# EAGLE design INT_RACK (EAGLE 9.6.2)

## Sheet 1 of 2: LINK_Composant
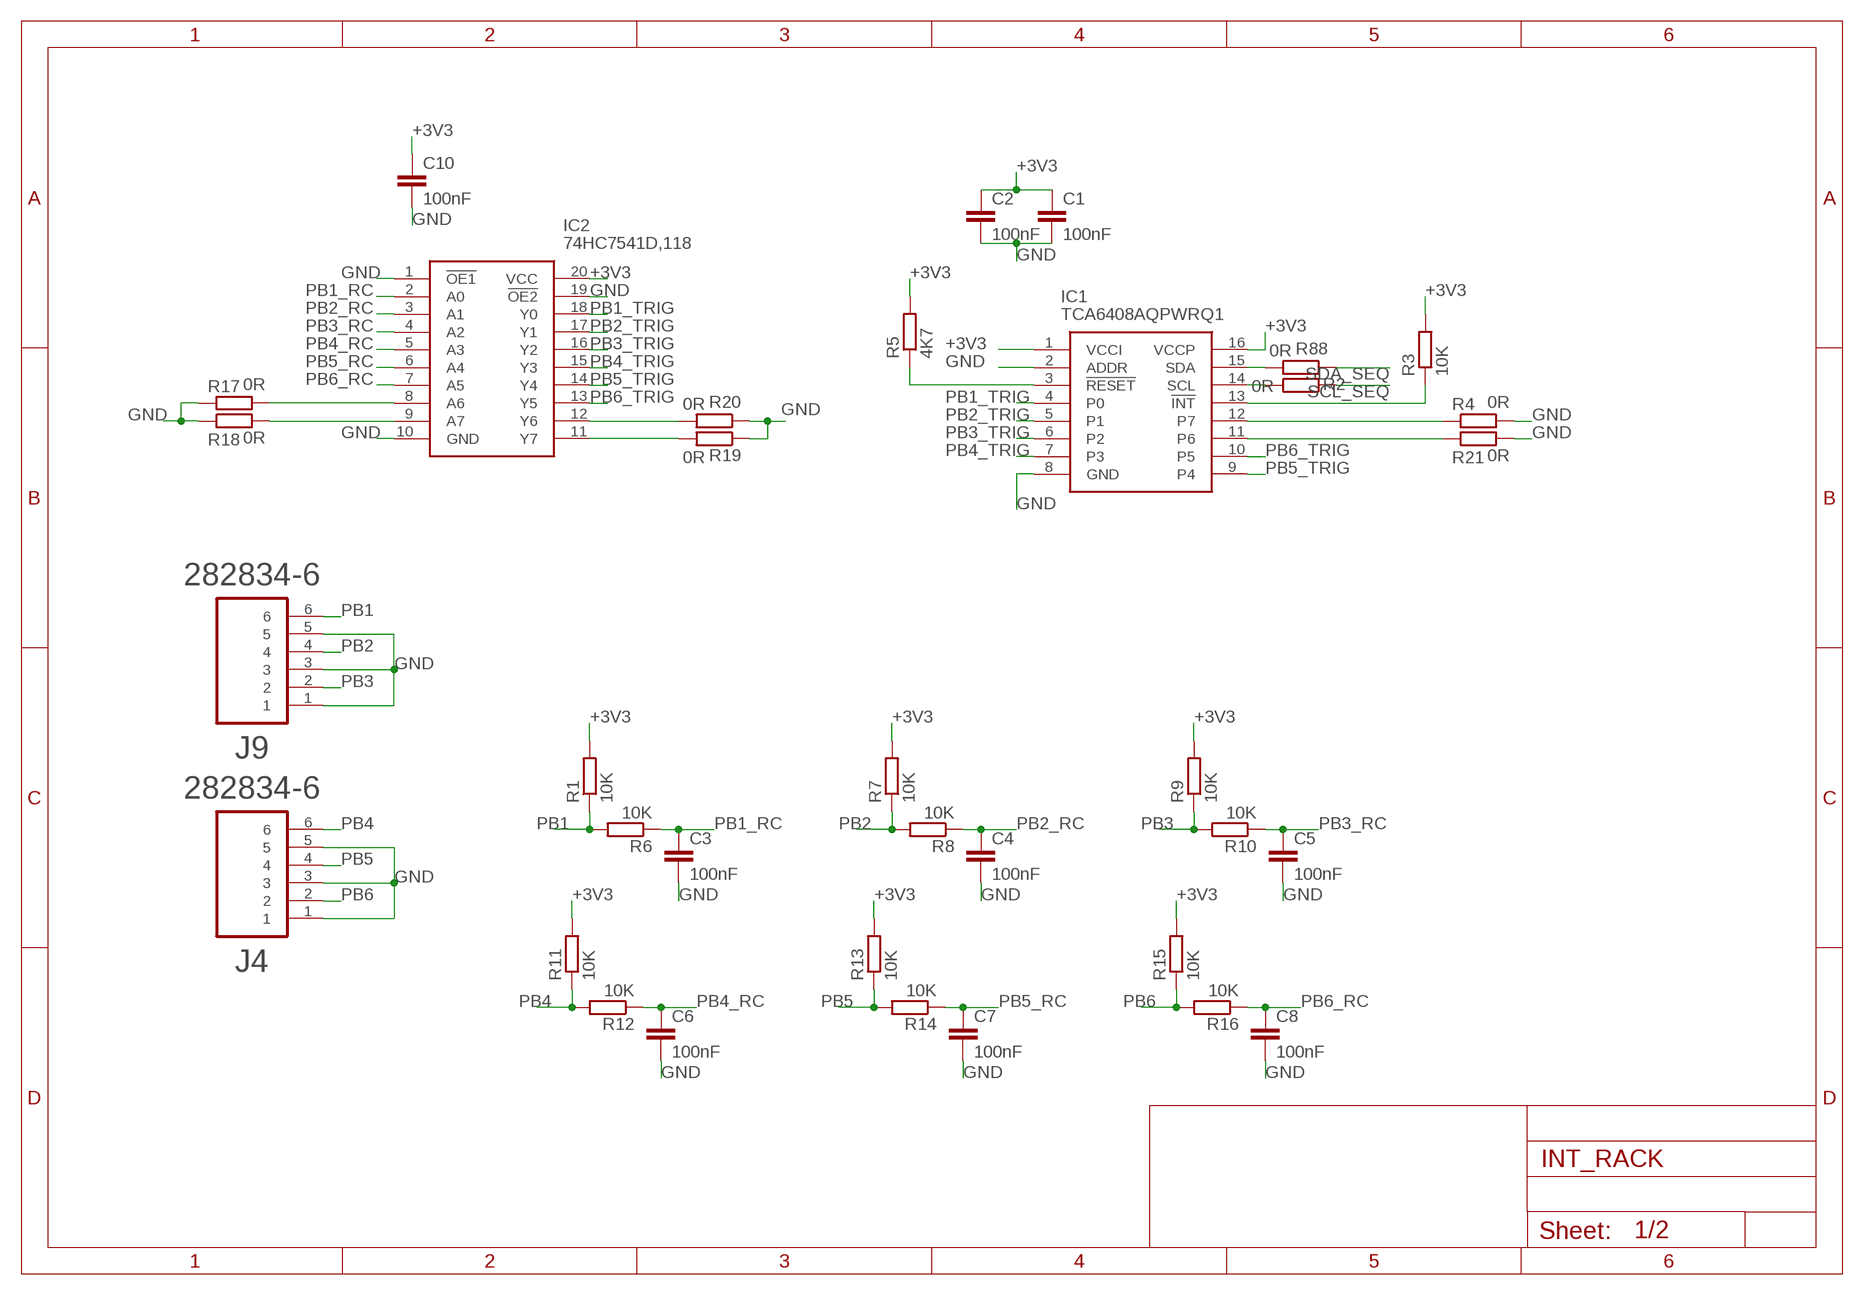
[diagram p0: schematic, sheet 1]

### Parts
C1  100nF  C-EUC0805  [C0805]
C2  100nF  C-EUC0805  [C0805]
C3  100nF  C-EUC0805  [C0805]
C4  100nF  C-EUC0805  [C0805]
C5  100nF  C-EUC0805  [C0805]
C6  100nF  C-EUC0805  [C0805]
C7  100nF  C-EUC0805  [C0805]
C8  100nF  C-EUC0805  [C0805]
C10  100nF  C-EUC0805  [C0805]
IC1  TCA6408AQPWRQ1  [SOP65P640X120-16N]
IC2  74HC7541D,118  [SOIC127P1032X265-20N]
J4  282834-6  [TE_282834-6]
J9  282834-6  [TE_282834-6]
R1  10K  R-EU_R0603  [R0603]
R2  0R  R-EU_R0603  [R0603]
R3  10K  R-EU_R0603  [R0603]
R4  0R  R-EU_R0603  [R0603]
R5  4K7  R-EU_R0603  [R0603]
R6  10K  R-EU_R0603  [R0603]
R7  10K  R-EU_R0603  [R0603]
R8  10K  R-EU_R0603  [R0603]
R9  10K  R-EU_R0603  [R0603]
R10  10K  R-EU_R0603  [R0603]
R11  10K  R-EU_R0603  [R0603]
R12  10K  R-EU_R0603  [R0603]
R13  10K  R-EU_R0603  [R0603]
R14  10K  R-EU_R0603  [R0603]
R15  10K  R-EU_R0603  [R0603]
R16  10K  R-EU_R0603  [R0603]
R17  0R  R-EU_R0603  [R0603]
R18  0R  R-EU_R0603  [R0603]
R19  0R  R-EU_R0603  [R0603]
R20  0R  R-EU_R0603  [R0603]
R21  0R  R-EU_R0603  [R0603]
R88  0R  R-EU_R0603  [R0603]

### Nets
+3V3 [Power]: C1.1 C2.1 C10.1 IC1.1(VCCI) IC1.16(VCCP) IC2.20(VCC) R1.2 R3.2 R5.2 R7.2 R9.2 R11.2 R13.2 R15.2 ; also sheet 2
GND: C1.2 C2.2 C3.2 C4.2 C5.2 C6.2 C7.2 C8.2 C10.2 IC1.2(ADDR) IC1.8(GND) IC2.1(!OE1) IC2.10(GND) IC2.19(!OE2) J4.1 J4.3 J4.5 J9.1 J9.3 J9.5 R4.2 R17.1 R18.1 R19.1 R20.1 R21.2 ; also sheet 2
N$1: IC1.11(P6) R21.1
N$2 [50Ohms]: IC1.14(SCL) R2.2
N$3: IC1.13(!INT) R3.1
N$4: IC1.12(P7) R4.1
N$5: IC1.3(!RESET) R5.1
N$6: IC2.12(Y6) R20.2
N$7: IC2.11(Y7) R19.2
N$12: IC2.8(A6) R17.2
N$13: IC2.9(A7) R18.2
N$55 [50Ohms]: IC1.15(SDA) R88.2
PB1: J9.6 R1.1 R6.2
PB1_RC: C3.1 IC2.2(A0) R6.1
PB1_TRIG: IC1.4(P0) IC2.18(Y0)
PB2: J9.4 R7.1 R8.2
PB2_RC: C4.1 IC2.3(A1) R8.1
PB2_TRIG: IC1.5(P1) IC2.17(Y1)
PB3: J9.2 R9.1 R10.2
PB3_RC: C5.1 IC2.4(A2) R10.1
PB3_TRIG: IC1.6(P2) IC2.16(Y2)
PB4: J4.6 R11.1 R12.2
PB4_RC: C6.1 IC2.5(A3) R12.1
PB4_TRIG: IC1.7(P3) IC2.15(Y3)
PB5: J4.4 R13.1 R14.2
PB5_RC: C7.1 IC2.6(A4) R14.1
PB5_TRIG: IC1.9(P4) IC2.14(Y4)
PB6: J4.2 R15.1 R16.2
PB6_RC: C8.1 IC2.7(A5) R16.1
PB6_TRIG: IC1.10(P5) IC2.13(Y5)
SCL_SEQ [50Ohms]: R2.1 ; also sheet 2
SDA_SEQ [50Ohms]: R88.1 ; also sheet 2

## Sheet 2 of 2: LINK_Connecteur
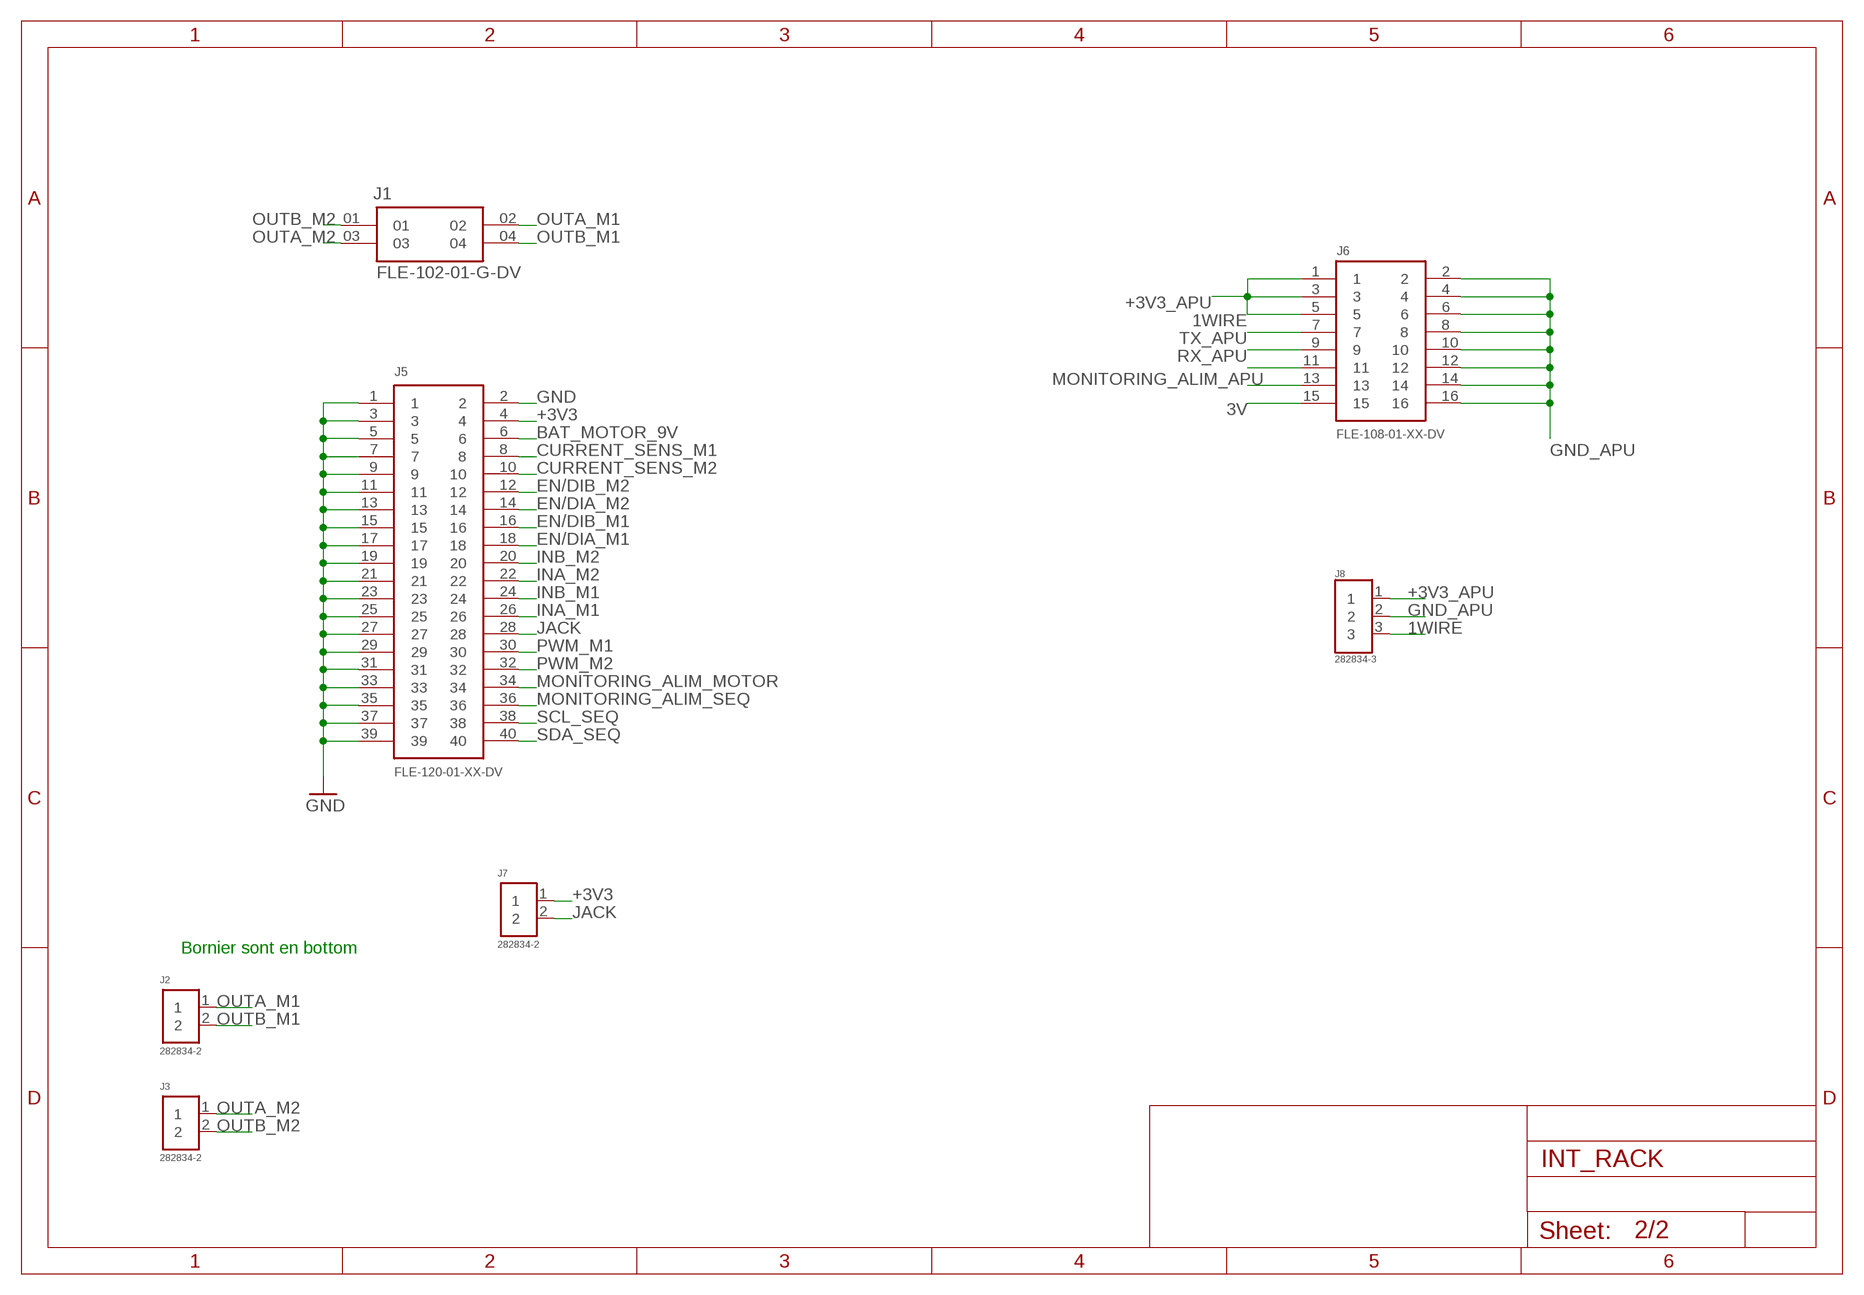
[diagram p1: schematic, sheet 2]

### Parts
J1  FLE-102-01-G-DV  [SAMTEC_FLE-102-01-G-DV]
J2  282834-2  [CONN_282834-2]
J3  282834-2  [CONN_282834-2]
J5  FLE-120-01-XX-DV  [FLE-120-01-XX-DV]
J6  FLE-108-01-XX-DV  [FLE-108-01-XX-DV]
J7  282834-2  [CONN_282834-2]
J8  282834-3  [TE_282834-3]

### Nets
1WIRE [50Ohms]: J6.7 J8.3
3V [Power]: J6.15
+3V3 [Power]: J5.4 J7.1 ; also sheet 1
+3V3_APU [Power]: J6.1 J6.3 J6.5 J8.1
BAT_MOTOR_9V [Power]: J5.6
CURRENT_SENS_M1: J5.8
CURRENT_SENS_M2: J5.10
EN/DIA_M1: J5.18
EN/DIA_M2: J5.14
EN/DIB_M1: J5.16
EN/DIB_M2: J5.12
GND: J5.1 J5.2 J5.3 J5.5 J5.7 J5.9 J5.11 J5.13 J5.15 J5.17 J5.19 J5.21 J5.23 J5.25 J5.27 J5.29 J5.31 J5.33 J5.35 J5.37 J5.39 ; also sheet 1
GND_APU: J6.2 J6.4 J6.6 J6.8 J6.10 J6.12 J6.14 J6.16 J8.2
INA_M1: J5.26
INA_M2: J5.22
INB_M1: J5.24
INB_M2: J5.20
JACK: J5.28 J7.2
MONITORING_ALIM_APU: J6.13
MONITORING_ALIM_MOTOR: J5.34
MONITORING_ALIM_SEQ: J5.36
OUTA_M1 [Motor]: J1.02 J2.1
OUTA_M2 [Motor]: J1.03 J3.1
OUTB_M1 [Motor]: J1.04 J2.2
OUTB_M2 [Motor]: J1.01 J3.2
PWM_M1: J5.30
PWM_M2: J5.32
RX_APU [50Ohms]: J6.11
SCL_SEQ [50Ohms]: J5.38 ; also sheet 1
SDA_SEQ [50Ohms]: J5.40 ; also sheet 1
TX_APU [50Ohms]: J6.9

### Notes on the sheet
- Bornier sont en bottom

## Library data of the parts
C1-C8 C10 = rcl:C-EU: CAPACITOR, European symbol; SPICEPREFIX: C
IC1 = TCA6408AQPWRQ1:TCA6408AQPWRQ1: Automotive Low-Voltage 8-Bit I2C and SMBus I/O Expander With Interrupt Output Source: Datasheet <http://www.ti.com/lit/gpn/tca6408a-q1>; ARROW_PART_NUMBER: TCA6408AQPWRQ1; ARROW_PRICE-STOCK: https://www.arrow.com/en/products/tca6408aqpwrq1/texas-instruments; DESCRIPTION: Automotive Low-Voltage 8-Bit I2C and SMBus I/O Expander With Interrupt Output; HEIGHT: 1.2mm; MANUFACTURER_NAME: Texas Instruments; MANUFACTURER_PART_NUMBER: TCA6408AQPWRQ1; MOUSER_PART_NUMBER: 595-TCA6408AQPWRQ1; MOUSER_PRICE-STOCK: https://www.mouser.co.uk/ProductDetail/Texas-Instruments/TCA6408AQPWRQ1/?qs=dn2ehRJXTX%252BDd5mX8WZrSw%3D%3D
IC2 = 74HC7541D_118:74HC7541D,118: 74HC(T)7541 - Octal Schmitt trigger buffer/line driver; 3-state@en-us Source: Datasheet <https://assets.nexperia.com/documents/data-sheet/74HC_HCT7541.pdf>; ARROW_PART_NUMBER: 74HC7541D,118; ARROW_PRICE-STOCK: https://www.arrow.com/en/products/74hc7541d118/nexperia; DESCRIPTION: 74HC(T)7541 - Octal Schmitt trigger buffer/line driver; 3-state@en-us; HEIGHT: 2.65mm; MANUFACTURER_NAME: Nexperia; MANUFACTURER_PART_NUMBER: 74HC7541D,118; MOUSER_PART_NUMBER: 771-74HC7541D-T; MOUSER_PRICE-STOCK: https://www.mouser.co.uk/ProductDetail/Nexperia/74HC7541D118?qs=P62ublwmbi8VXtyI4hHtzA%3D%3D
J1 = FLE-102-01-G-DV:FLE-102-01-G-DV: Check prices <https://pricing.snapeda.com/parts/FLE-102-01-G-DV/Samtec/view-part?ref=eda>; AVAILABILITY: Bad; DESCRIPTION: 4 Position Receptacle Connector Surface Mount; MF: Samtec; MP: FLE-102-01-G-DV; PACKAGE: None; PRICE: None; PURCHASE-URL: https://pricing.snapeda.com/search/part/FLE-102-01-G-DV/?ref=eda
J2 J3 J7 = 282834-2:282834-2: Terminal block; 2.54mm; angled 90°; 0.03÷1mm2; ways: 2; 10A; H: 10mm Check prices <https://pricing.snapeda.com/parts/282834-2/TE%20Connectivity/view-part?ref=eda>; AVAILABILITY: Good; CENTERLINE_PITCH: 2.54 mm[.1 in]; COMMENT: 282834-2; DESCRIPTION: Wire-To-Board Terminal Block, 2, 150 V, 10 A, 30 Awg, 16 Awg, 1.4 Mm; EU_ROHS_COMPLIANCE: Compliant with Exemptions; MF: TE Connectivity; MP: 282834-2; NUMBER_OF_POSITIONS: 2; PACKAGE: None; PRICE: None; PURCHASE-URL: https://pricing.snapeda.com/search/part/282834-2/?ref=eda
J4 J9 = 282834-6:282834-6: TERM BLOCK 6POS SIDE ENT 2.54MM Check prices <https://pricing.snapeda.com/parts/282834-6/TE%20Connectivity/view-part?ref=eda>; AVAILABILITY: Good; COMMENT: 282834-6; DESCRIPTION: Wire-To-Board Terminal Block, 6, 150 V, 10 A, 30 Awg, 16 Awg, 1.4 Mm; EU_ROHS_COMPLIANCE: Compliant with Exemptions; MF: TE Connectivity; MP: 282834-6; PACKAGE: None; PRICE: None; PURCHASE-URL: https://pricing.snapeda.com/search/part/282834-6/?ref=eda
J5 = FLE-120-01-XX-DV:FLE-120-01-XX-DV: DOUBLE ROW 0.050"X0.050" STRIP ASSEMBLY. Check prices <https://pricing.snapeda.com/parts/FLE-120-01-G-DV/Samtec/view-part?ref=eda>; AVAILABILITY: Bad; DESCRIPTION: 40 Position Receptacle Connector Surface Mount; MF: Samtec; MP: FLE-120-01-G-DV; PACKAGE: None; PRICE: None; PURCHASE-URL: https://pricing.snapeda.com/search/part/FLE-120-01-G-DV/?ref=eda
J6 = FLE-108-01-XX-DV:FLE-108-01-XX-DV: DOUBLE ROW 0.050"X0.050" STRIP ASSEMBLY. Check prices <https://pricing.snapeda.com/parts/FLE-108-01-G-DV/Samtec/view-part?ref=eda>; AVAILABILITY: Bad; DESCRIPTION: 16 Position Receptacle Connector Surface Mount; MF: Samtec; MP: FLE-108-01-G-DV; PACKAGE: None; PRICE: None; PURCHASE-URL: https://pricing.snapeda.com/search/part/FLE-108-01-G-DV/?ref=eda
J8 = 282834-3:282834-3: Conn; Term Blk; PCB; Wire Receptacle; 3; 2.54mm; 30-16AWG; Green; 10A; 150V; M1.6 Check prices <https://pricing.snapeda.com/parts/282834-3/TE%20Connectivity/view-part?ref=eda>; AVAILABILITY: Good; COMMENT: 282834-3; DESCRIPTION: 3 Position Wire to Board Terminal Block Horizontal with Board 0.100 (2.54mm); EU_ROHS_COMPLIANCE: Compliant with Exemptions; MF: TE Connectivity; MP: 282834-3; PACKAGE: None; PRICE: None; PURCHASE-URL: https://pricing.snapeda.com/search/part/282834-3/?ref=eda
R1-R21 R88 = rcl:R-EU_: RESISTOR, European symbol; SPICEPREFIX: R

## Net classes
0 default: width 0.2 mm, clearance 0.127 mm
1 Power: width 0.4 mm, clearance 0.2 mm
2 50Ohms: width 0.147 mm, clearance 0.127 mm
3 Motor: width 0.813 mm, clearance 1 mm

## Board
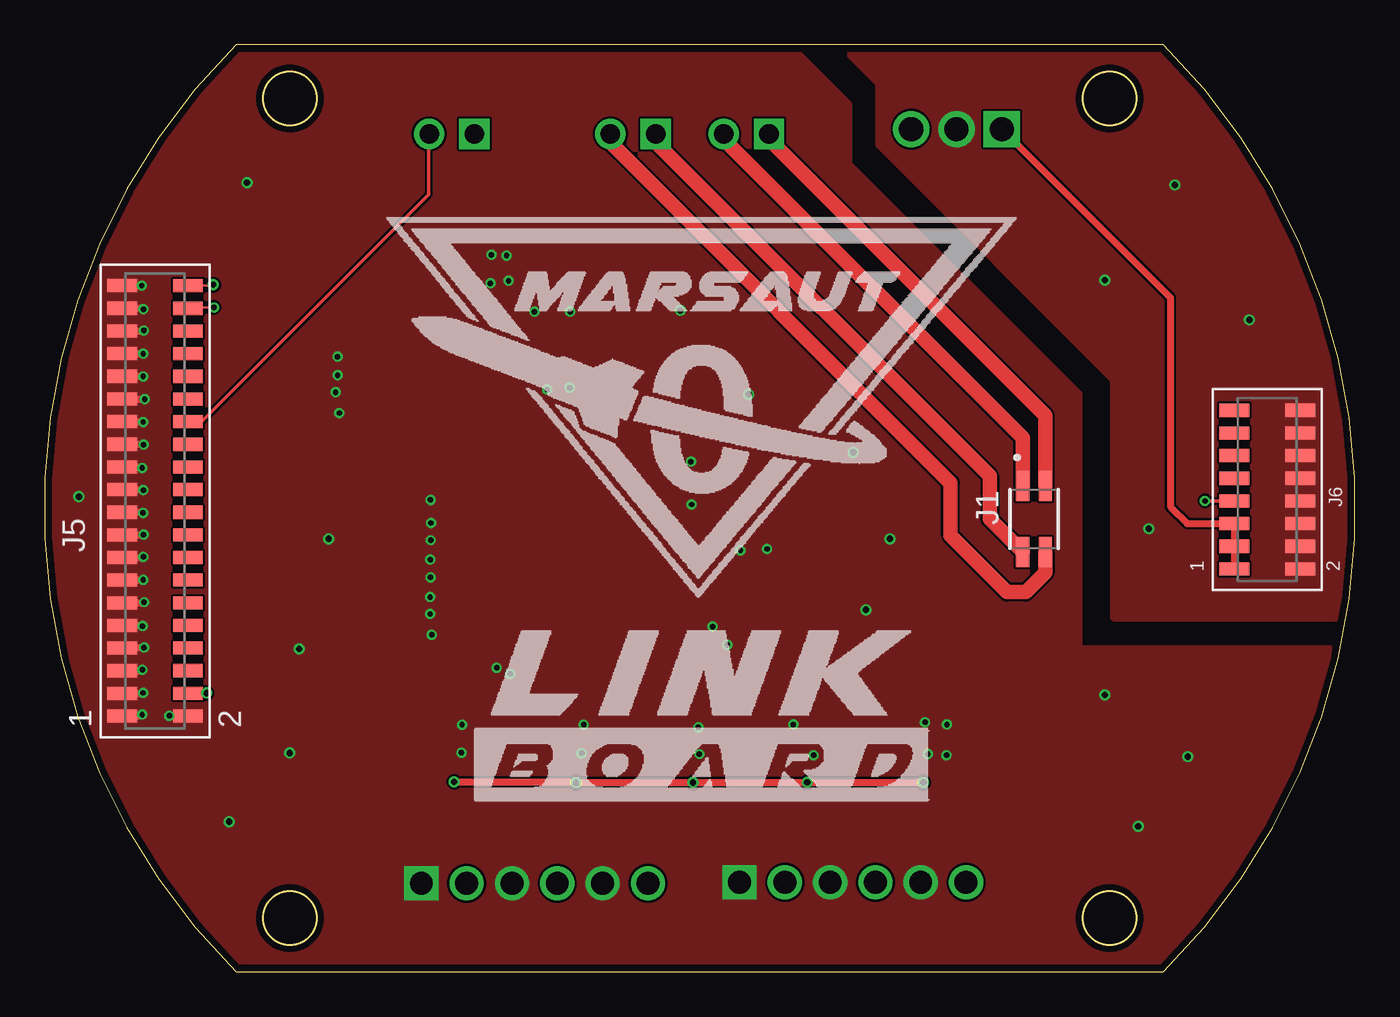
[diagram p2: board, top side]
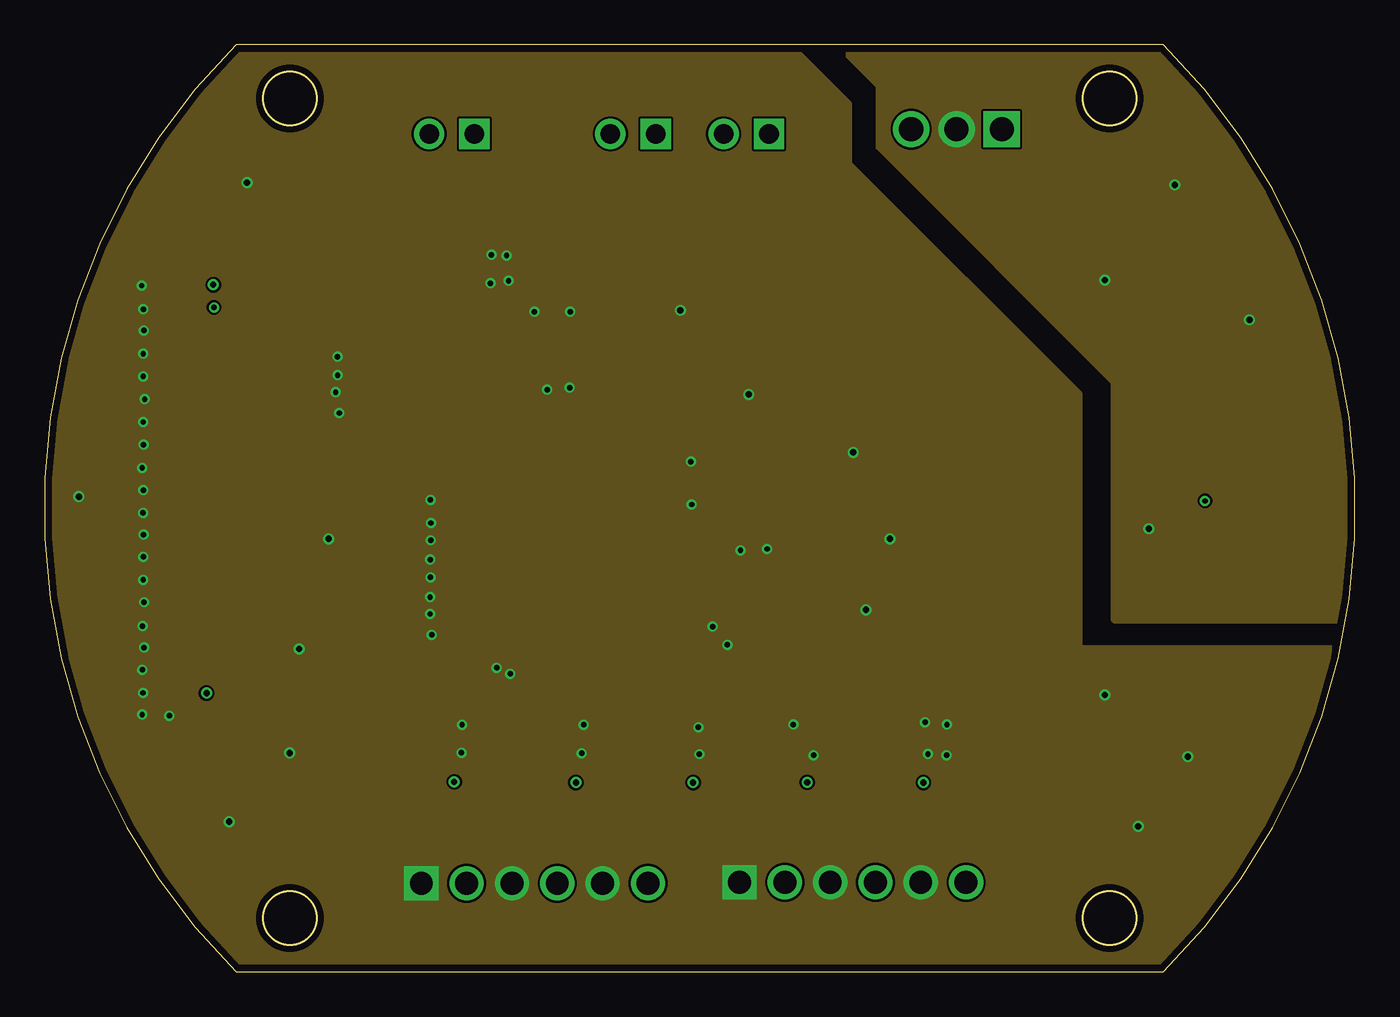
[diagram p3: board, inner layer Route2]
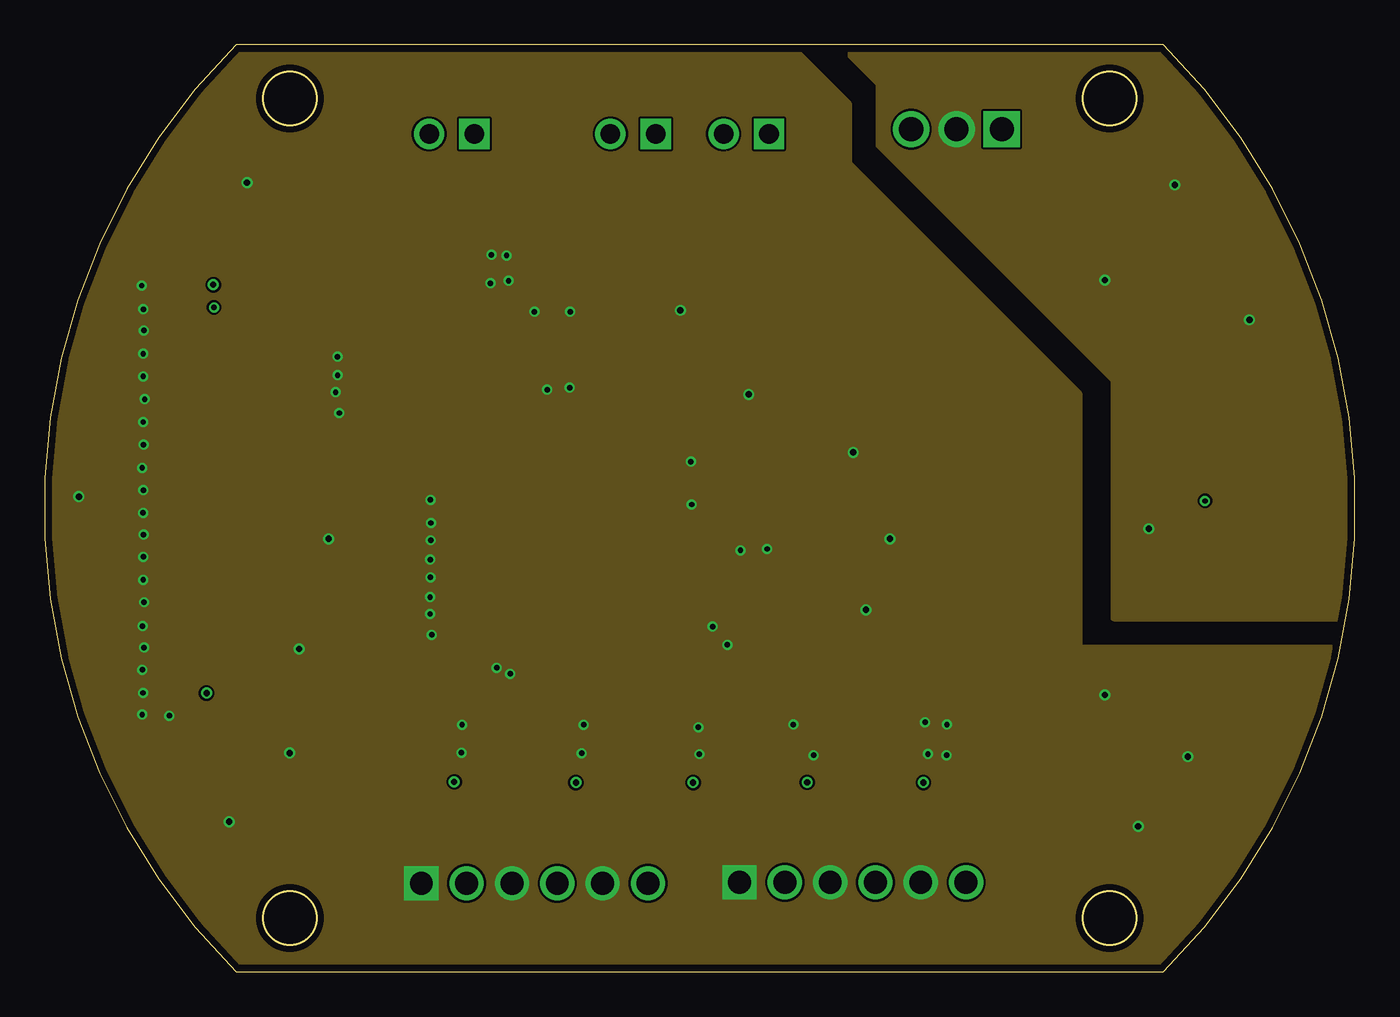
[diagram p4: board, inner layer Route15]
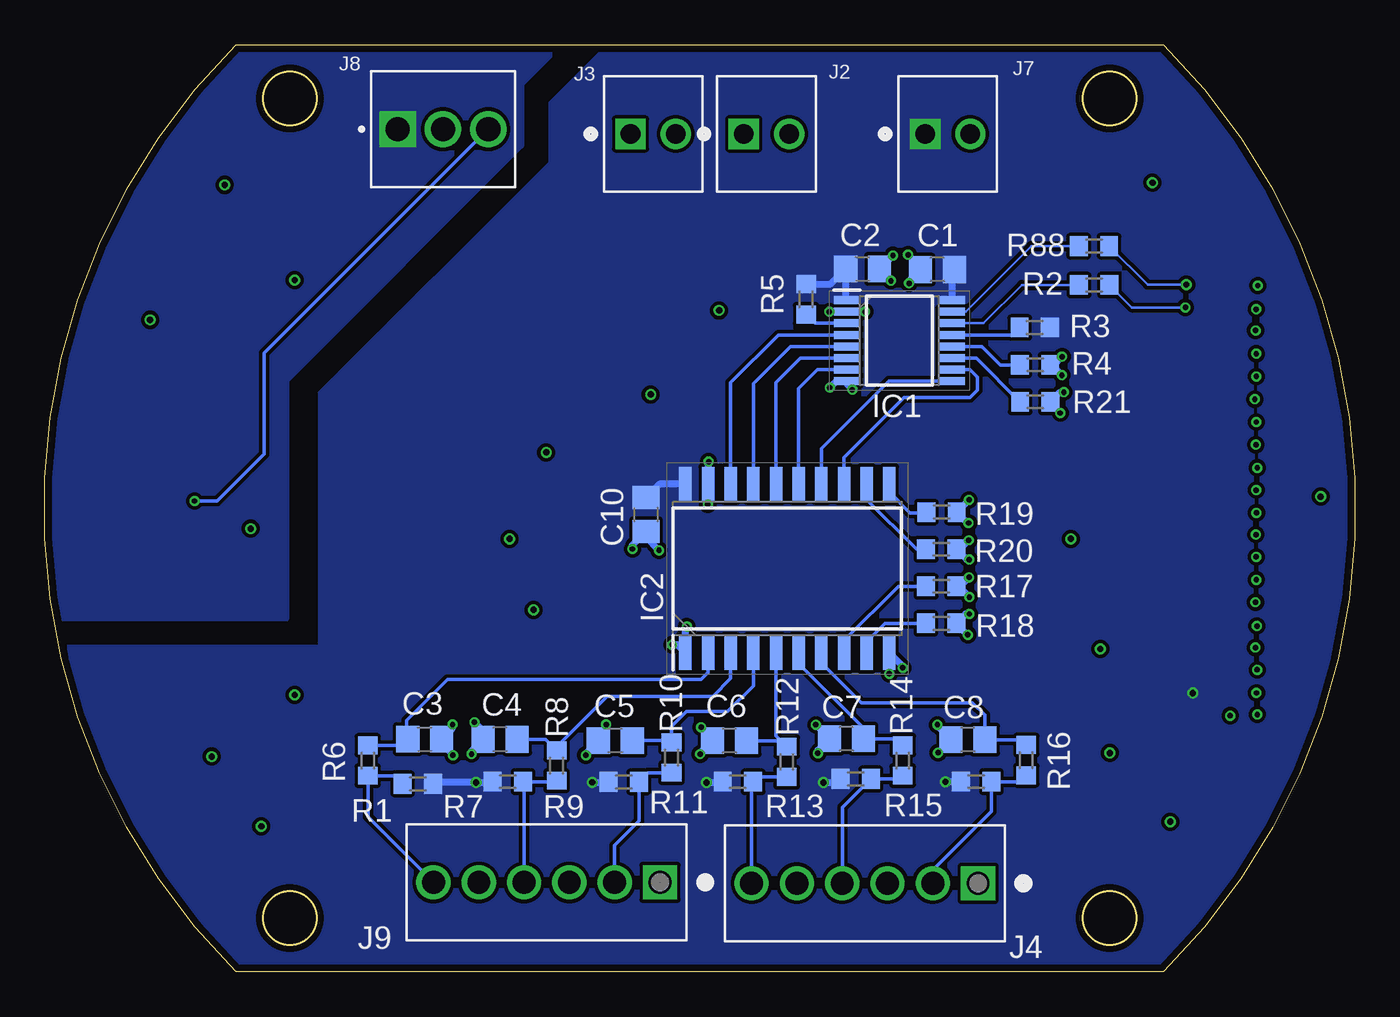
[diagram p5: board, bottom side, seen from below]

Size 73.46 x 52 mm. Coordinates in mm from the lower left corner, seen from the top.
Outline: 10.73,0 62.73,0 arc90 62.73,52 10.73,52 arc90 10.73,0
Outline: circle at 13.75,3.02 radius 1.5
Outline: circle at 59.71,48.98 radius 1.5
Outline: circle at 13.75,48.98 radius 1.5
Outline: circle at 59.71,3.02 radius 1.5
Copper layers (1+2*15+16): Top 0.035mm / dielectric 0.1mm / Route2 0.0175mm / dielectric 1.265mm / Route15 0.0175mm / dielectric 0.1mm / Bottom 0.035mm
Design rules "Marsaut0": minimum track width 3.5mil, minimum drill 0.2mm, track to track 4mil, track to pad 0.2mm, pad to pad 5mil, via to via 0.5mm, smd to smd 5mil, copper to edge 0.4mm, drill to drill 0.5mm, minimum pad ring 0.3mm, minimum via ring 0.13mm, stop-mask expansion 4mil, vias tented up to drill 0mil, thermal gap 10mil

### Footprints (pad centres in the part's own frame; a part is rotated, then mirrored left to right if it is on the bottom)
C0805 = smd 1.3 x 1.5: 1 -0.95,0; 2 0.95,0
SOP65P640X120-16N = smd 1.475 x 0.45: 1 -2.938,2.275; 2 -2.938,1.625; 3 -2.938,0.975; 4 -2.938,0.325; 5 -2.938,-0.325; 6 -2.938,-0.975; 7 -2.938,-1.625; 8 -2.938,-2.275; 9 2.938,-2.275; 10 2.938,-1.625; 11 2.938,-0.975; 12 2.938,-0.325; 13 2.938,0.325; 14 2.938,0.975; 15 2.938,1.625; 16 2.938,2.275
SOIC127P1032X265-20N = smd 1.95 x 0.7: 1 -4.725,5.715; 2 -4.725,4.445; 3 -4.725,3.175; 4 -4.725,1.905; 5 -4.725,0.635; 6 -4.725,-0.635; 7 -4.725,-1.905; 8 -4.725,-3.175; 9 -4.725,-4.445; 10 -4.725,-5.715; 11 4.725,-5.715; 12 4.725,-4.445; 13 4.725,-3.175; 14 4.725,-1.905; 15 4.725,-0.635; 16 4.725,0.635; 17 4.725,1.905; 18 4.725,3.175; 19 4.725,4.445; 20 4.725,5.715
SAMTEC_FLE-102-01-G-DV = smd 0.74 x 1.675: 01 -0.635,1.843; 02 -0.635,-1.843; 03 0.635,1.843; 04 0.635,-1.843
CONN_282834-2 = drill 1.1 square: 1 -1.27,0 | drill 1.1: 2 1.27,0
TE_282834-6 = drill 1.28 pad 1.92 square: 1 -6.35,0 | drill 1.28 pad 1.92: 2 -3.81,0; 3 -1.27,0; 4 1.27,0; 5 3.81,0; 6 6.35,0
FLE-120-01-XX-DV = smd 0.737 x 1.676: 1 -12.065,1.841; 2 -12.065,-1.841; 3 -10.795,1.841; 4 -10.795,-1.841; 5 -9.525,1.841; 6 -9.525,-1.841; 7 -8.255,1.841; 8 -8.255,-1.841; 9 -6.985,1.841; 10 -6.985,-1.841; 11 -5.715,1.841; 12 -5.715,-1.841; 13 -4.445,1.841; 14 -4.445,-1.841; 15 -3.175,1.841; 16 -3.175,-1.841; 17 -1.905,1.841; 18 -1.905,-1.841; 19 -0.635,1.841; 20 -0.635,-1.841; 21 0.635,1.841; 22 0.635,-1.841; 23 1.905,1.841; 24 1.905,-1.841; 25 3.175,1.841; 26 3.175,-1.841; 27 4.445,1.841; 28 4.445,-1.841; 29 5.715,1.841; 30 5.715,-1.841; 31 6.985,1.841; 32 6.985,-1.841; 33 8.255,1.841; 34 8.255,-1.841; 35 9.525,1.841; 36 9.525,-1.841; 37 10.795,1.841; 38 10.795,-1.841; 39 12.065,1.841; 40 12.065,-1.841
FLE-108-01-XX-DV = smd 0.737 x 1.676: 1 -4.445,1.841; 2 -4.445,-1.841; 3 -3.175,1.841; 4 -3.175,-1.841; 5 -1.905,1.841; 6 -1.905,-1.841; 7 -0.635,1.841; 8 -0.635,-1.841; 9 0.635,1.841; 10 0.635,-1.841; 11 1.905,1.841; 12 1.905,-1.841; 13 3.175,1.841; 14 3.175,-1.841; 15 4.445,1.841; 16 4.445,-1.841
TE_282834-3 = drill 1.36 square: 1 0,0 | drill 1.36: 2 2.54,0; 3 5.08,0
R0603 = smd 1 x 1.1: 1 -0.85,0; 2 0.85,0

### Placement (x,y rotation side)
C1  23.4,39.39 180 bottom
C2  27.6,39.42 0 bottom
C3  52.15,13.05 0 bottom
C4  47.92,13.04 180 bottom
C5  41.46,12.98 180 bottom
C6  35.06,12.97 180 bottom
C7  28.51,13.08 180 bottom
C8  21.69,13.03 180 bottom
C10  39.75,25.65 270 bottom
IC1  25.54,35.4 0 bottom
IC2  31.82,22.62 90 bottom
J1  55.47,25.4 0 top
J2  32.99,46.99 0 bottom
J3  39.34,46.99 0 bottom
J4  27.47,4.98 180 bottom
J5  6.19,26.42 90 top
J6  68.55,27.05 90 top
J7  22.83,46.99 0 bottom
J8  53.66,47.26 0 bottom
J9  45.31,5.02 180 bottom
R1  52.54,10.55 0 bottom
R2  14.62,38.52 180 bottom
R3  17.95,36.14 0 bottom
R4  17.94,34.04 0 bottom
R5  30.77,37.72 90 bottom
R6  55.34,11.86 270 bottom
R7  47.49,10.67 180 bottom
R8  44.75,11.58 270 bottom
R9  40.99,10.66 180 bottom
R10  38.31,12.03 270 bottom
R11  34.59,10.67 180 bottom
R12  31.86,11.78 270 bottom
R13  27.99,10.83 180 bottom
R14  25.36,11.86 270 bottom
R15  21.23,10.67 180 bottom
R16  18.42,11.88 270 bottom
R17  23.19,21.63 180 bottom
R18  23.2,19.55 180 bottom
R19  23.17,25.79 180 bottom
R20  23.19,23.71 180 bottom
R21  17.92,31.97 0 bottom
R88  14.63,40.7 180 bottom

### Tracks (layer width: path | path; a pad name or v marks a point on that pad's centre or on a via)
1WIRE  (via drill 0.3)
  Top 0.2: v65.06,26.41 J6.7
  Bottom 0.2: J8.3 61.15,34.7 61.15,29.04 63.78,26.41 v65.06,26.41
+3V3  (via drill 0.35)
  Top 0.4: J5.4 9.07,15.62 v9.08,15.64 | v22.96,10.66 29.79,10.66 29.81,10.64 v29.79,10.62 v36.36,10.62 v42.74,10.62 v42.75,10.63 49.26,10.63 v49.27,10.62
  Bottom 0.4: C1.1 22.6,39.24 IC1.16 | IC1.1 28.55,37.75 C2.1 29.41,38.57 R5.2 | IC2.20 38.99,27.35 C10.1 | R15.2 22.95,10.67 v22.96,10.66 | v29.79,10.62 29.04,10.62 R13.2 | v36.36,10.62 35.49,10.62 R11.2 | v42.75,10.63 41.87,10.63 R9.2 | R7.2 48.39,10.62 v49.27,10.62 51.61,10.62 R1.2
  pour Bottom (no thermals): 4.35,54.59 39.14,54.59 45.04,48.68 45.04,45.34 57.96,32.42 57.96,18.15 74.64,18.15 74.64,-2.14 74.72,-2.23 -5.1,-2.23 -5.1,54.24 -5.04,54.29 3.97,54.29 4.27,54.59
+3V3_APU
  Top 0.4: J8.1 63.12,37.8 63.12,26.08 64.05,25.15 J6.5 J6.3 J6.1
  pour Bottom (no thermals): 46.76,49.79 46.76,46.35 59.94,33.17 59.94,19.84 74.81,19.84 74.9,19.75 74.9,56.61 74.99,56.7 39.88,56.7
GND  (via drill 0.3, 0.35)
  Top 0.4: J5.2 7,14.35 v6.99,14.36 v6.99,14.37 | J5.39 v5.45,38.49 | J5.37 5.43,37.21 5.49,37.15 5.53,37.15 v5.54,37.16 | J5.35 5.55,35.94 v5.57,35.97 v5.57,35.98 | J5.33 5.47,34.67 5.49,34.65 5.52,34.65 v5.53,34.66 | J5.31 5.49,33.4 5.52,33.38 v5.53,33.39 | J5.29 5.58,32.13 v5.61,32.11 | J5.27 5.48,30.86 5.52,30.82 v5.53,30.84 | J5.25 5.52,29.59 v5.55,29.56 | J5.23 5.42,28.32 v5.47,28.27 | J5.21 5.51,27.05 v5.54,27.02 v5.53,27.02 | J5.19 5.51,25.78 5.53,25.76 v5.52,25.75 | J5.17 5.5,24.51 5.52,24.52 v5.55,24.52 | J5.15 5.53,23.24 5.55,23.26 v5.54,23.27 | J5.13 5.51,21.97 v5.53,21.99 | J5.11 5.54,20.7 v5.57,20.73 | v5.57,20.73 | J5.9 5.45,19.43 v5.49,19.39 v5.5,19.4 | J5.7 4.38,18.19 v5.57,18.19 | J5.5 5.44,16.89 v5.49,16.94 v5.48,16.95 | J5.3 5.47,15.62 5.5,15.65 v5.52,15.65 | J5.1 5.38,14.35 v5.46,14.43 v5.47,14.43
  Bottom 0.4: v50.59,13.87 50.59,13.66 C3.2 51.2,12.8 v50.56,12.16 | v50.56,12.16 | v26.1,16.72 v26.09,16.73 26.1,16.75 IC2.10 25.35,17.14 v25.35,17.05 | v26.1,16.72 | v21.63,26.47 v21.64,26.47 R19.1 21.73,25.19 v21.66,25.19 v21.66,25.18 | v21.65,24.21 22.15,23.71 R20.1 21.76,23.12 v21.62,23.12 | v36.23,28.61 36.23,27.38 IC2.19 36.26,26.25 36.28,26.23 v36.28,26.21 | v37.46,19.36 37.46,19.35 37.53,19.27 IC2.1 37.98,18.35 v38.28,18.35 | v21.63,22.13 21.65,22.13 22.15,21.63 R17.1 22.21,21.63 v21.61,21.02 | v21.61,20.08 21.82,20.08 R18.1 21.71,18.91 v21.7,18.91 | v39.01,23.65 39.75,24.38 C10.2 40.51,23.93 v40.51,23.72 | v26.01,38.76 26.01,38.78 C2.2 25.91,40.17 25.9,40.17 v25.9,40.18 | v25.05,40.22 24.35,39.52 C1.2 24.97,38.77 24.97,38.61 v25,38.61 | v27.46,37.02 IC1.2 29.37,37.02 29.38,37.01 29.46,37.01 v29.47,37.02 | v16.32,32.51 16.53,32.51 R21.2 17.07,31.89 v16.52,31.34 | v16.42,34.5 16.88,34.04 R4.2 17,34.04 v16.43,33.46 | v29.44,32.76 29.42,32.76 29.06,33.12 IC1.8 28.48,32.95 v28.18,32.65 | v41.98,13.87 41.98,13.41 C5.2 43.12,12.27 v43.12,12.16 | v23.4,13.86 v23.39,13.86 23.39,13.78 C8.2 23.35,12.31 v23.35,12.3 v23.36,12.3 | v30.22,13.86 30.22,13.84 C7.2 30.11,12.43 v30.11,12.27 | v49.36,14.01 48.87,13.52 C4.2 49.51,12.4 49.51,12.23 v49.52,12.22 | v36.65,13.73 v36.64,13.73 36.01,13.1 C6.2 36.7,12.28 v36.7,12.21
  other vias: 10.35,8.43 13.74,12.28 1.92,26.65 14.27,18.12 15.92,24.29 11.35,44.26 35.64,37.1 39.48,32.39 45.33,29.13 47.39,24.29 46.05,20.31 59.44,15.53 64.1,12.08 61.31,8.16
  pour Top (no thermals): 4.38,54.58 39.17,54.58 45.07,48.68 45.07,45.33 57.99,32.42 57.99,18.15 74.67,18.15 74.67,-2.15 74.7,-2.19 -5.07,-2.19 -5.07,54.23 -5.02,54.29 3.99,54.29 4.3,54.59
  pour Route2 (no thermals): 4.38,54.58 39.17,54.58 45.07,48.68 45.07,45.33 57.99,32.42 57.99,18.15 74.67,18.15 74.67,-2.15 -5.02,-2.15 -5.02,54.29 3.99,54.29 4.3,54.59
  pour Route15 (no thermals): 4.37,54.6 39.16,54.6 45.07,48.69 45.07,45.35 57.98,32.43 57.98,18.16 74.66,18.16 74.66,-2.13 -5.05,-2.13 -5.07,-2.11 -5.07,54.25 -5.02,54.3 3.99,54.3 4.29,54.6
GND_APU  (via drill 0.35)
  other vias: 61.91,24.86 67.55,36.57 63.37,44.13 59.44,38.8
  pour Top (no thermals): 46.75,49.81 46.75,46.38 59.93,33.2 59.93,19.86 74.8,19.86 74.89,19.78 74.89,56.64 74.97,56.72 39.87,56.72
  pour Route2 (no thermals): 46.77,49.7 46.77,46.26 59.95,33.08 59.95,19.75 74.82,19.75 74.91,19.66 74.91,56.52 74.99,56.61 39.89,56.61
  pour Route15 (no thermals): 46.76,49.8 46.76,46.37 59.94,33.19 59.94,19.85 74.81,19.85 74.9,19.76 74.9,56.63 74.99,56.71 39.88,56.71
JACK
  Top 0.2: J5.28 8.08,30.81 8.74,30.81 21.52,43.59 21.52,46.95 J7.2
N$1
  Bottom 0.2: IC1.11 21.22,34.42 R21.1
N$2
  Bottom 0.147: IC1.14 20.84,36.37 18.68,38.52 R2.2
N$3
  Bottom 0.2: IC1.13 19.21,35.72 R3.1
N$4
  Bottom 0.2: IC1.12 20.9,35.07 19.87,34.04 R4.1
N$5
  Bottom 0.2: R5.1 30.27,36.37 IC1.3
N$6
  Bottom 0.2: IC2.12 27.37,26.5 24.58,23.71 R20.2
N$7
  Bottom 0.2: IC2.11 26.1,26.91 24.94,25.75 24.07,25.75 R19.2
N$12
  Bottom 0.2: IC2.8 28.64,18.59 25.61,21.63 R17.2
N$13
  Bottom 0.2: IC2.9 27.4,17.92 27.4,18.49 26.34,19.55 R18.2
N$55
  Bottom 0.147: IC1.15 21.82,37.02 18.14,40.7 R88.2
OUTA_M1
  Top 0.813: J1.02 52.99,25.4 52.99,27.81 34.26,46.54 J2.1
OUTA_M2
  Top 0.813: J1.03 56.1,31.2 40.61,46.69 J3.1
OUTB_M1
  Top 0.813: J2.2 31.47,46.74 50.79,27.42 50.79,24.48 53.96,21.3 55,21.3 56.1,22.4 J1.04
OUTB_M2
  Top 0.813: J1.01 54.83,29.93 38.03,46.73 38.03,46.95 J3.2
PB1
  Bottom 0.2: R6.2 55.33,11.01 | 55.33,11.01 53.85,11.01 R1.1 | J9.6 55.33,8.69 55.33,11.01
PB1_RC
  Bottom 0.2: C3.1 53.17,12.98 | 53.17,12.98 53.44,12.71 R6.1 | IC2.2 36.26,16.8 36.67,16.39 50.85,16.39 50.87,16.41 53.17,14.1 53.17,12.98
PB1_TRIG
  Bottom 0.2: IC1.4 32.32,35.72 34.99,33.05 IC2.18
PB2
  Bottom 0.2: R8.2 44.81,10.67 R7.1 46.58,10.61 J9.4
PB2_RC
  Bottom 0.2: C4.1 45.37,13.04 44.85,12.53 | 44.85,12.53 R8.1 | IC2.3 34.99,16.45 35.99,15.46 41.92,15.46 44.85,12.53
PB2_TRIG
  Bottom 0.2: IC1.5 31.65,35.07 33.72,33 IC2.17
PB3
  Bottom 0.2: R10.2 39.63,11.18 R9.1 40.13,10.64 40.13,8.49 41.5,7.11 J9.2
PB3_RC
  Bottom 0.2: C5.1 38.41,12.98 R10.1 38.31,13.77 37.49,14.6 35.16,14.6 33.72,16.04 IC2.4
PB3_TRIG
  Bottom 0.2: IC1.6 31.08,34.42 32.45,33.05 IC2.16
PB4
  Bottom 0.2: R12.2 33.48,10.93 R11.1 33.82,10.58 J4.6
PB4_RC
  Bottom 0.2: C6.1 32.2,12.97 R12.1 32.45,13.23 IC2.5
PB4_TRIG
  Bottom 0.2: IC1.7 30.13,33.77 31.18,32.72 IC2.15
PB5
  Bottom 0.2: R14.2 25.54,10.82 R13.1 28.74,9.22 J4.4
PB5_RC
  Bottom 0.2: C7.1 27.4,13.08 | 27.4,13.08 25.73,13.08 R14.1 | IC2.6 31.18,17.32 27.4,13.53 27.4,13.08
PB5_TRIG
  Bottom 0.2: IC2.14 29.91,29.34 26.13,33.12 IC1.9
PB6
  Bottom 0.2: R16.2 18.78,10.67 R15.1 20.38,9 23.66,5.72 J4.2
PB6_RC
  Bottom 0.2: R16.1 18.72,13.03 C8.1 20.74,14.4 21.43,15.09 27.67,15.09 29.91,17.33 IC2.7
PB6_TRIG
  Bottom 0.2: IC2.13 28.64,28.85 25.29,32.2 21.59,32.2 21.17,32.62 21.17,33.37 21.59,33.79 22.59,33.79 IC1.10
SCL_SEQ  (via drill 0.3)
  Top 0.147: v9.5,37.27 8.09,37.27 J5.38
  Bottom 0.147: R2.1 12.52,37.27 v9.5,37.27
SDA_SEQ  (via drill 0.35)
  Top 0.147: J5.40 9.4,38.48 v9.46,38.54
  Bottom 0.147: v9.46,38.54 11.62,38.54 R88.1